# EAGLE design 2023-08-03 LVMi Thermistors (EAGLE 9.6.2)

## Sheet 1 of 4
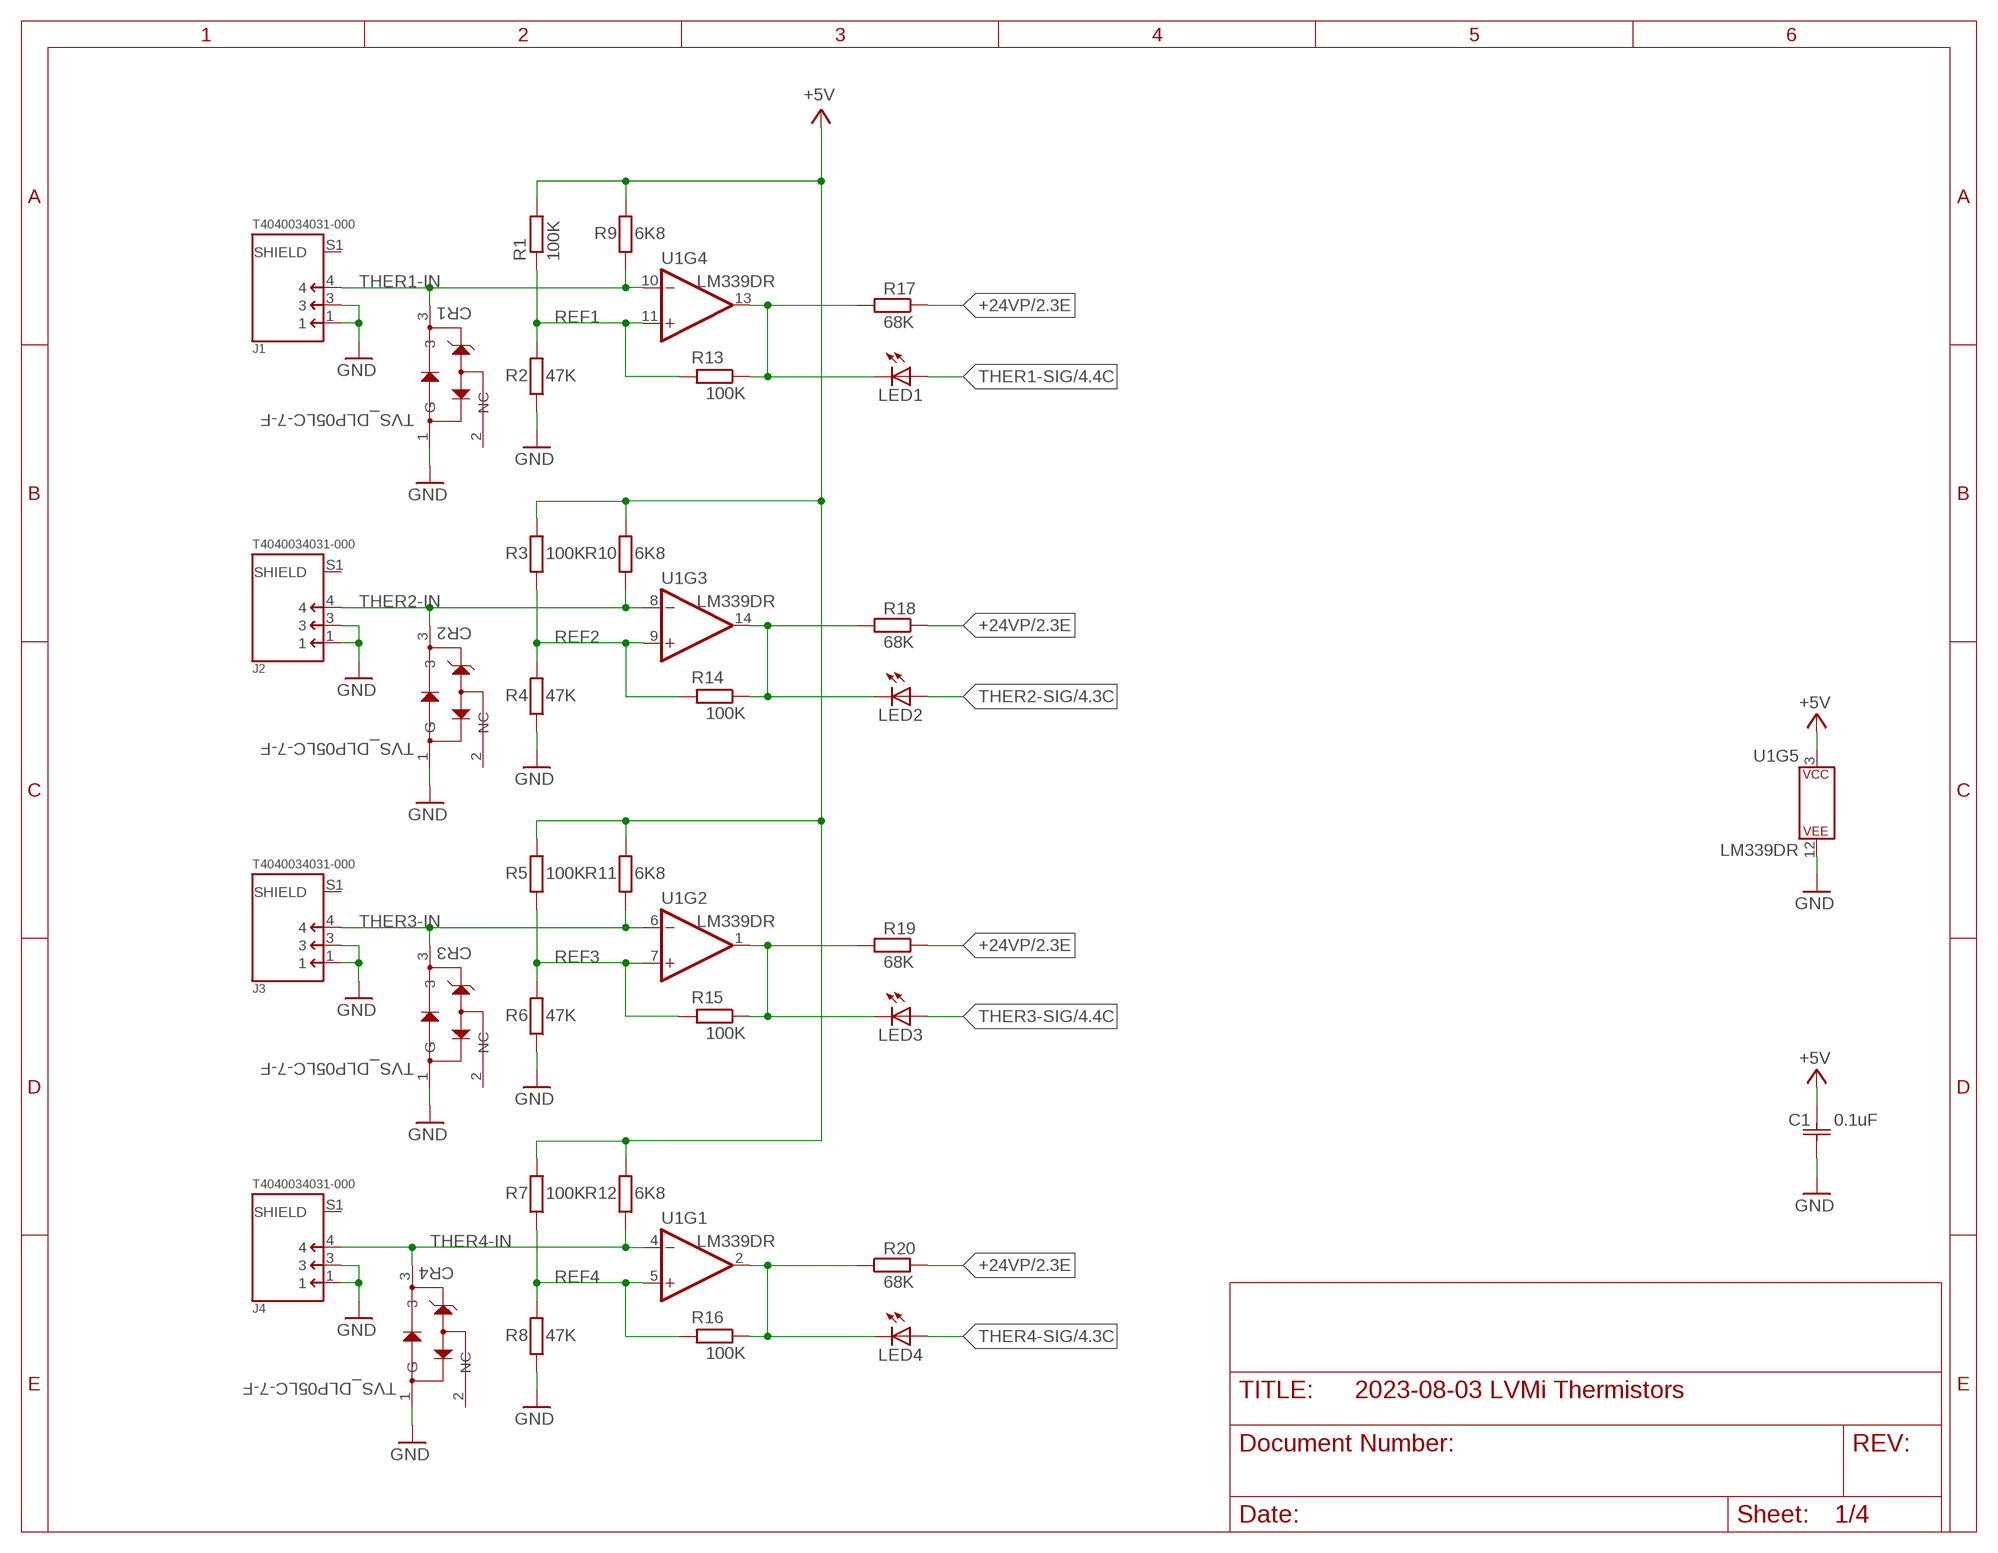
[diagram p0: schematic, sheet 1]

### Parts
C1  0.1uF  CAPTHRUHOLE  [K104K15X7RF5TL2_VIS]
CR1  TVS_DLP05LC-7-F  [SOT23_DLP05LC_DIO]
CR2  TVS_DLP05LC-7-F  [SOT23_DLP05LC_DIO]
CR3  TVS_DLP05LC-7-F  [SOT23_DLP05LC_DIO]
CR4  TVS_DLP05LC-7-F  [SOT23_DLP05LC_DIO]
J1  T4040034031-000  [TE_T4040034031-000]
J2  T4040034031-000  [TE_T4040034031-000]
J3  T4040034031-000  [TE_T4040034031-000]
J4  T4040034031-000  [TE_T4040034031-000]
LED1  LED5MM  [LED5MM]
LED2  LED5MM  [LED5MM]
LED3  LED5MM  [LED5MM]
LED4  LED5MM  [LED5MM]
R1  100K  R-EU_0204/7  [0204/7]
R2  47K  R-EU_0204/7  [0204/7]
R3  100K  R-EU_0204/7  [0204/7]
R4  47K  R-EU_0204/7  [0204/7]
R5  100K  R-EU_0204/7  [0204/7]
R6  47K  R-EU_0204/7  [0204/7]
R7  100K  R-EU_0204/7  [0204/7]
R8  47K  R-EU_0204/7  [0204/7]
R9  6K8  R-EU_0204/7  [0204/7]
R10  6K8  R-EU_0204/7  [0204/7]
R11  6K8  R-EU_0204/7  [0204/7]
R12  6K8  R-EU_0204/7  [0204/7]
R13  100K  R-EU_0204/7  [0204/7]
R14  100K  R-EU_0204/7  [0204/7]
R15  100K  R-EU_0204/7  [0204/7]
R16  100K  R-EU_0204/7  [0204/7]
R17  68K  R-EU_0204/7  [0204/7]
R18  68K  R-EU_0204/7  [0204/7]
R19  68K  R-EU_0204/7  [0204/7]
R20  68K  R-EU_0204/7  [0204/7]
U1  LM339DR  LM339SOIC-14  [SOIC127P599X175-14]

### Nets
+5V: C1.2 R1.2 R3.2 R5.2 R7.2 R9.2 R10.2 R11.2 R12.2 U1.3(P$V+) ; also sheet 2,3,4
+24VP: R17.1 R18.1 R19.1 R20.2 ; also sheet 2,3,4
GND: C1.1 CR1.1(G) CR2.1(G) CR3.1(G) CR4.1(G) J1.1 J1.3 J2.1 J2.3 J3.1 J3.3 J4.1 J4.3 R2.1 R4.1 R6.1 R8.1 U1.12(P$V-) ; also sheet 2,3,4
REF1: R1.1 R2.2 R13.2 U1.11(+IN)
REF2: R3.1 R4.2 R14.2 U1.9(+IN)
REF3: R5.1 R6.2 R15.2 U1.7(+IN)
REF4: R7.1 R8.2 R16.2 U1.5(+IN)
THER1-IN: CR1.3 J1.4 LED1.K(C) R9.1 R13.1 R17.2 U1.10(-IN) U1.13(OUT)
THER1-SIG: LED1.A ; also sheet 4
THER2-IN: CR2.3 J2.4 LED2.K(C) R10.1 R14.1 R18.2 U1.8(-IN) U1.14(OUT)
THER2-SIG: LED2.A ; also sheet 4
THER3-IN: CR3.3 J3.4 LED3.K(C) R11.1 R15.1 R19.2 U1.1(OUT) U1.6(-IN)
THER3-SIG: LED3.A ; also sheet 4
THER4-IN: CR4.3 J4.4 LED4.K(C) R12.1 R16.1 R20.1 U1.2(OUT) U1.4(-IN)
THER4-SIG: LED4.A ; also sheet 4
Unconnected: CR1.2(NC) CR2.2(NC) CR3.2(NC) CR4.2(NC) J1.S1(SHIELD) J2.S1(SHIELD) J3.S1(SHIELD) J4.S1(SHIELD)

### Notes on the sheet
- Thermistor Connectors and Comparators

## Sheet 2 of 4
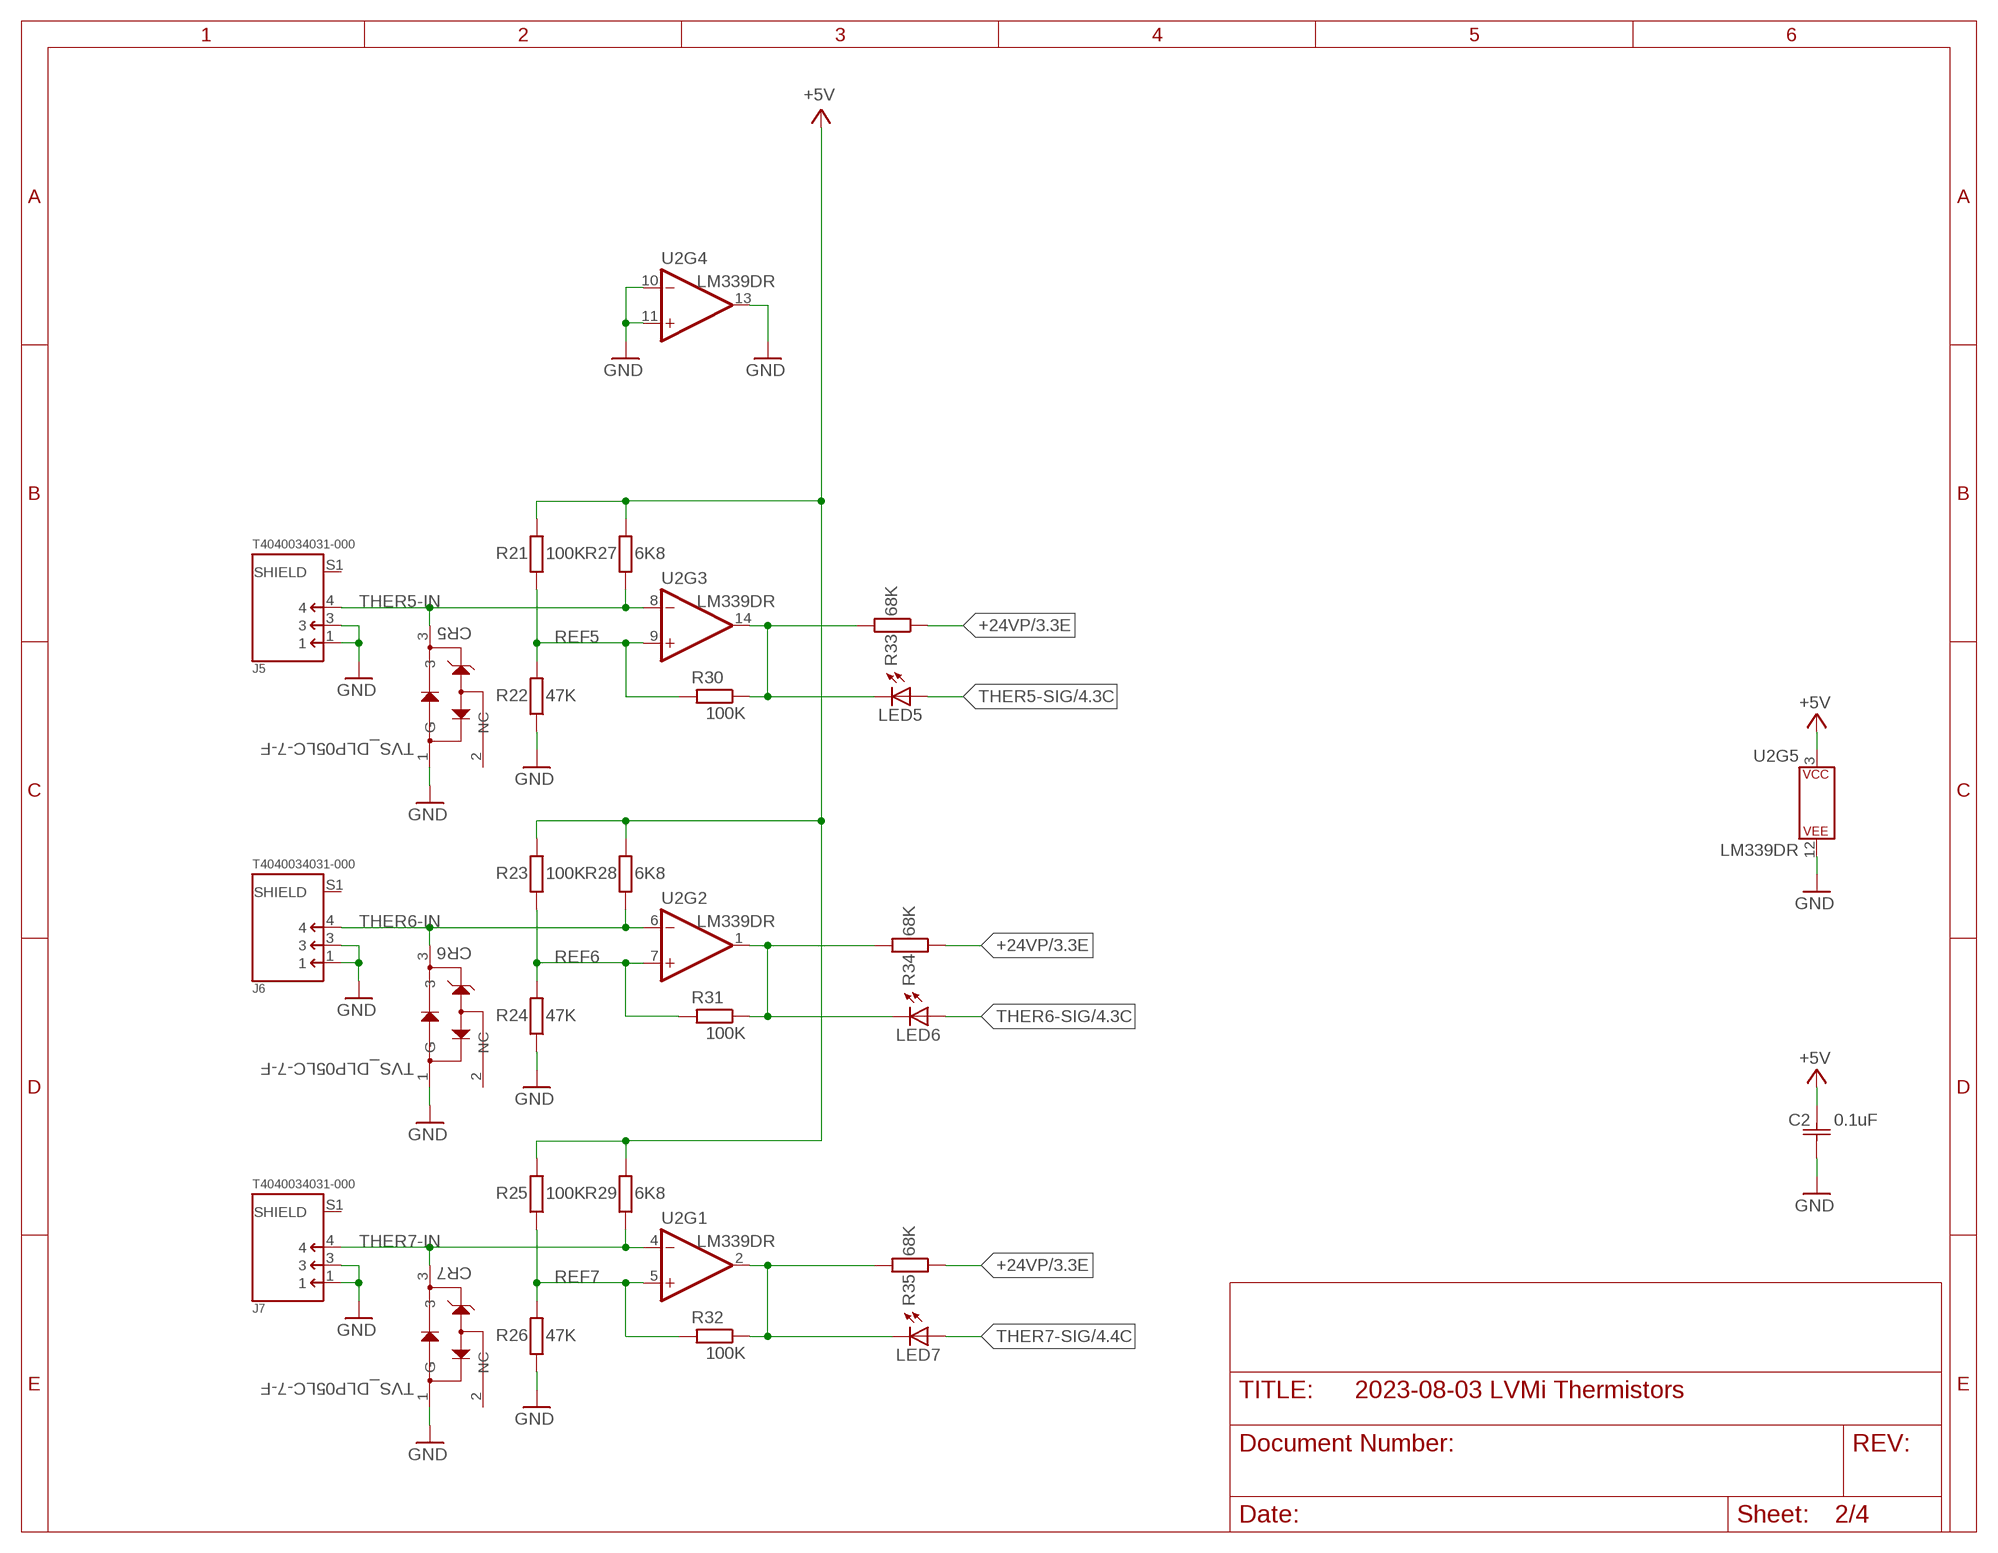
[diagram p1: schematic, sheet 2]

### Parts
C2  0.1uF  CAPTHRUHOLE  [K104K15X7RF5TL2_VIS]
CR5  TVS_DLP05LC-7-F  [SOT23_DLP05LC_DIO]
CR6  TVS_DLP05LC-7-F  [SOT23_DLP05LC_DIO]
CR7  TVS_DLP05LC-7-F  [SOT23_DLP05LC_DIO]
J5  T4040034031-000  [TE_T4040034031-000]
J6  T4040034031-000  [TE_T4040034031-000]
J7  T4040034031-000  [TE_T4040034031-000]
LED5  LED5MM  [LED5MM]
LED6  LED5MM  [LED5MM]
LED7  LED5MM  [LED5MM]
R21  100K  R-EU_0204/7  [0204/7]
R22  47K  R-EU_0204/7  [0204/7]
R23  100K  R-EU_0204/7  [0204/7]
R24  47K  R-EU_0204/7  [0204/7]
R25  100K  R-EU_0204/7  [0204/7]
R26  47K  R-EU_0204/7  [0204/7]
R27  6K8  R-EU_0204/7  [0204/7]
R28  6K8  R-EU_0204/7  [0204/7]
R29  6K8  R-EU_0204/7  [0204/7]
R30  100K  R-EU_0204/7  [0204/7]
R31  100K  R-EU_0204/7  [0204/7]
R32  100K  R-EU_0204/7  [0204/7]
R33  68K  R-EU_0204/7  [0204/7]
R34  68K  R-EU_0204/7  [0204/7]
R35  68K  R-EU_0204/7  [0204/7]
U2  LM339DR  LM339SOIC-14  [SOIC127P599X175-14]

### Nets
+5V: C2.2 R21.2 R23.2 R25.2 R27.2 R28.2 R29.2 U2.3(P$V+) ; also sheet 1,3,4
+24VP: R33.1 R34.1 R35.1 ; also sheet 1,3,4
GND: C2.1 CR5.1(G) CR6.1(G) CR7.1(G) J5.1 J5.3 J6.1 J6.3 J7.1 J7.3 R22.1 R24.1 R26.1 U2.10(-IN) U2.11(+IN) U2.12(P$V-) U2.13(OUT) ; also sheet 1,3,4
REF5: R21.1 R22.2 R30.2 U2.9(+IN)
REF6: R23.1 R24.2 R31.2 U2.7(+IN)
REF7: R25.1 R26.2 R32.2 U2.5(+IN)
THER5-IN: CR5.3 J5.4 LED5.K(C) R27.1 R30.1 R33.2 U2.8(-IN) U2.14(OUT)
THER5-SIG: LED5.A ; also sheet 4
THER6-IN: CR6.3 J6.4 LED6.K(C) R28.1 R31.1 R34.2 U2.1(OUT) U2.6(-IN)
THER6-SIG: LED6.A ; also sheet 4
THER7-IN: CR7.3 J7.4 LED7.K(C) R29.1 R32.1 R35.2 U2.2(OUT) U2.4(-IN)
THER7-SIG: LED7.A ; also sheet 4
Unconnected: CR5.2(NC) CR6.2(NC) CR7.2(NC) J5.S1(SHIELD) J6.S1(SHIELD) J7.S1(SHIELD)

## Sheet 3 of 4
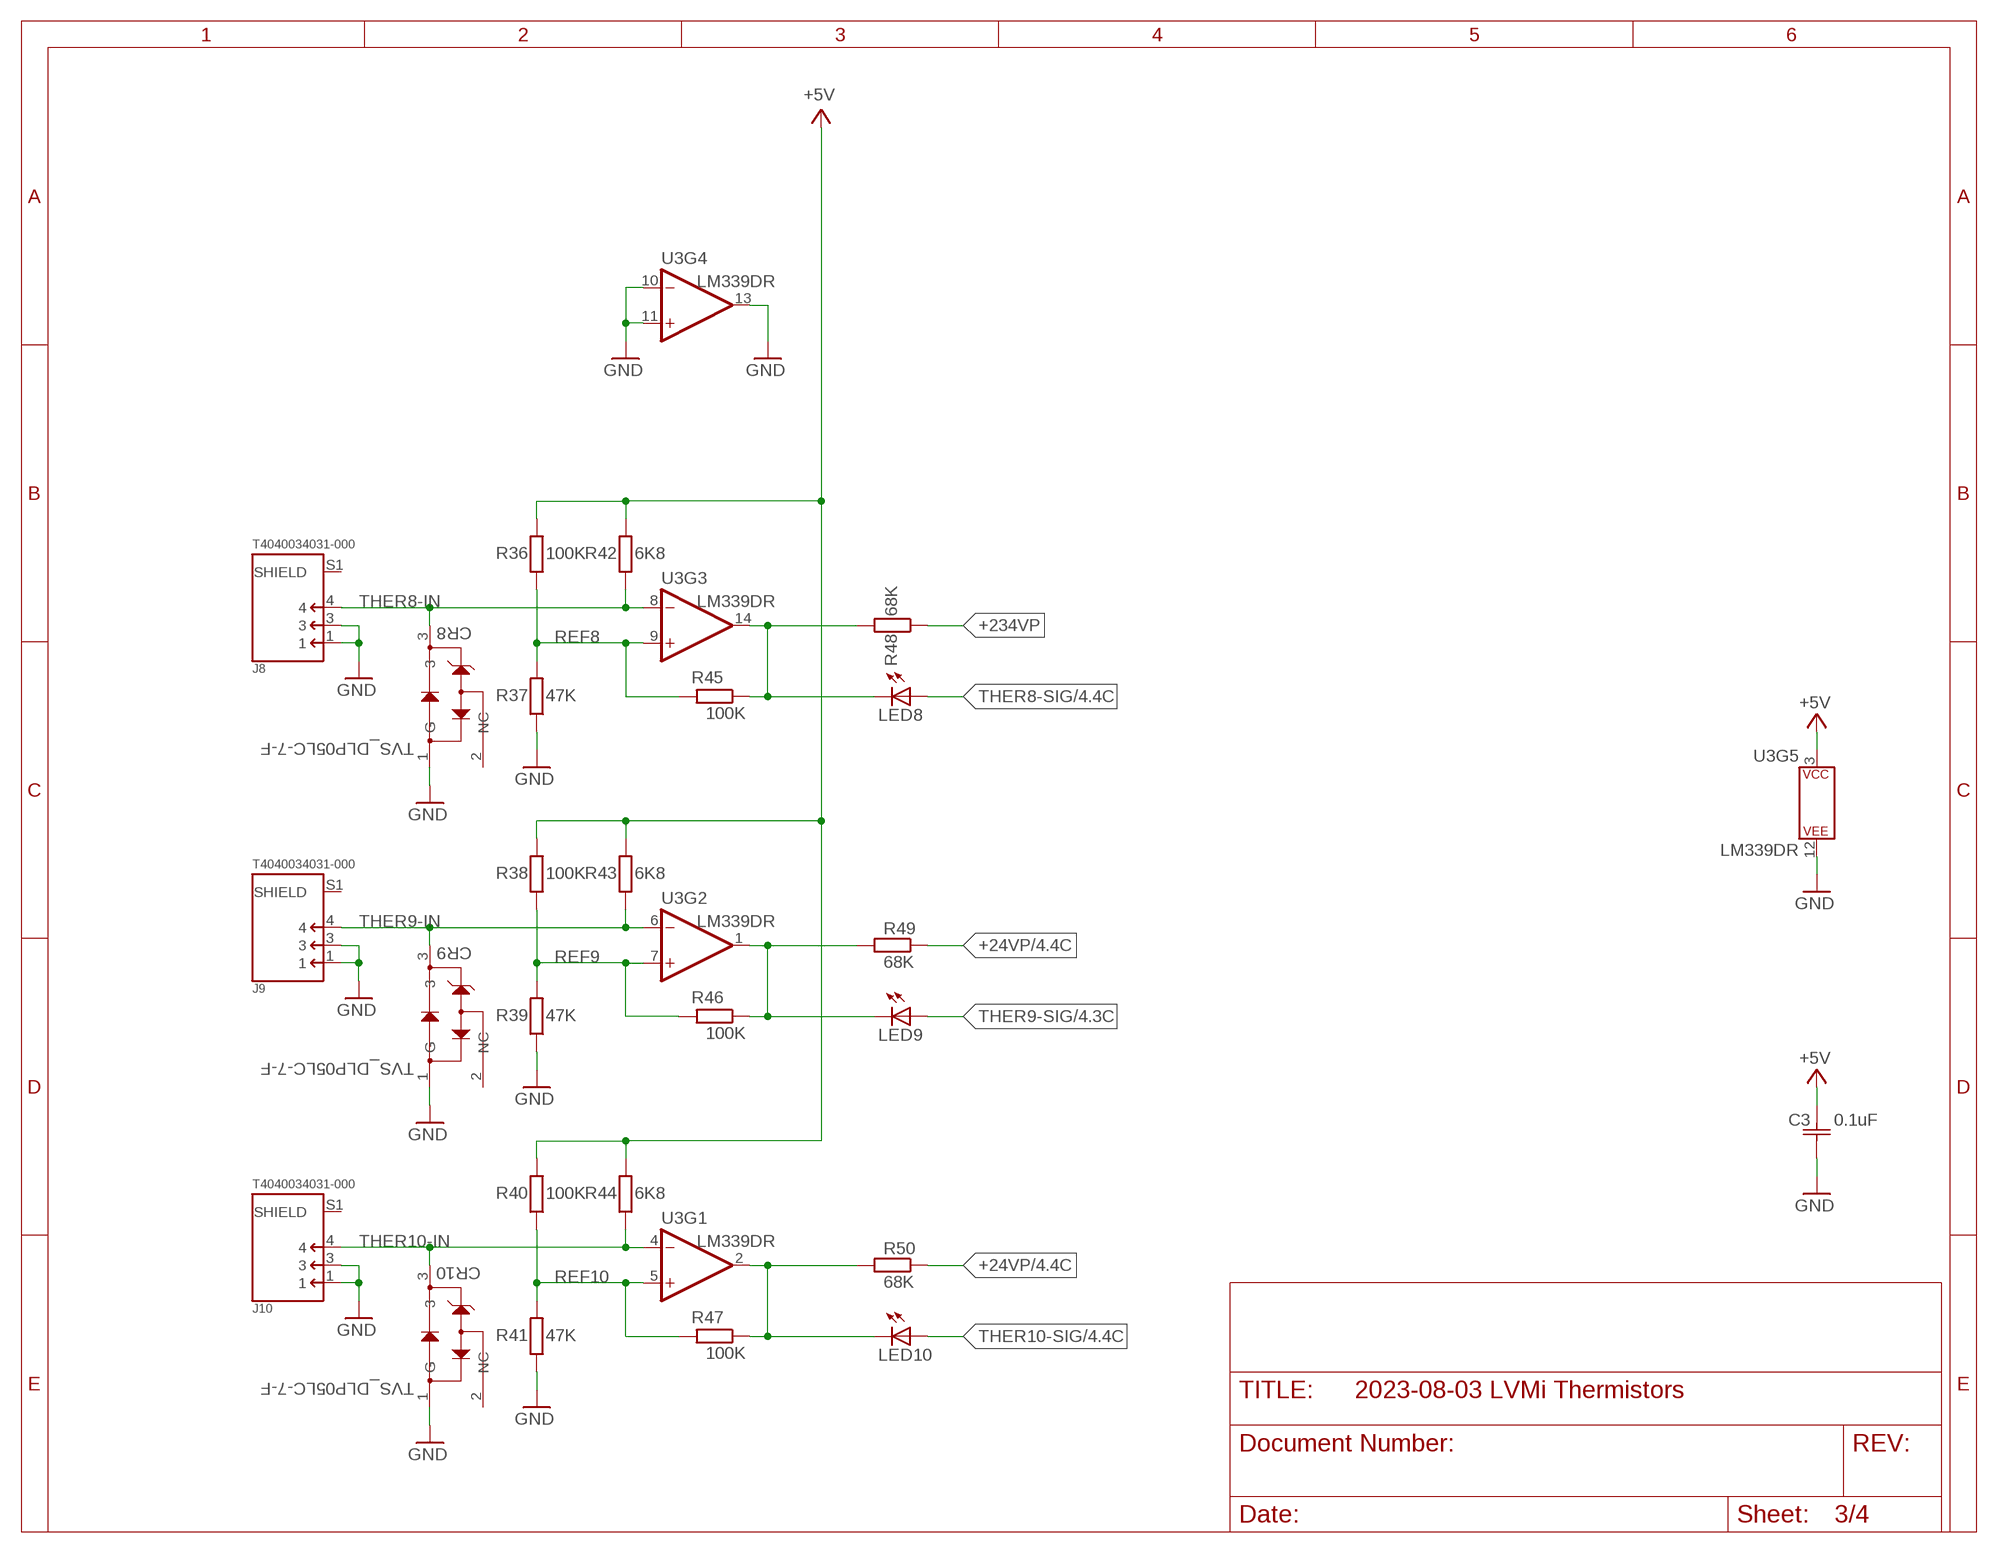
[diagram p2: schematic, sheet 3]

### Parts
C3  0.1uF  CAPTHRUHOLE  [K104K15X7RF5TL2_VIS]
CR8  TVS_DLP05LC-7-F  [SOT23_DLP05LC_DIO]
CR9  TVS_DLP05LC-7-F  [SOT23_DLP05LC_DIO]
CR10  TVS_DLP05LC-7-F  [SOT23_DLP05LC_DIO]
J8  T4040034031-000  [TE_T4040034031-000]
J9  T4040034031-000  [TE_T4040034031-000]
J10  T4040034031-000  [TE_T4040034031-000]
LED8  LED5MM  [LED5MM]
LED9  LED5MM  [LED5MM]
LED10  LED5MM  [LED5MM]
R36  100K  R-EU_0204/7  [0204/7]
R37  47K  R-EU_0204/7  [0204/7]
R38  100K  R-EU_0204/7  [0204/7]
R39  47K  R-EU_0204/7  [0204/7]
R40  100K  R-EU_0204/7  [0204/7]
R41  47K  R-EU_0204/7  [0204/7]
R42  6K8  R-EU_0204/7  [0204/7]
R43  6K8  R-EU_0204/7  [0204/7]
R44  6K8  R-EU_0204/7  [0204/7]
R45  100K  R-EU_0204/7  [0204/7]
R46  100K  R-EU_0204/7  [0204/7]
R47  100K  R-EU_0204/7  [0204/7]
R48  68K  R-EU_0204/7  [0204/7]
R49  68K  R-EU_0204/7  [0204/7]
R50  68K  R-EU_0204/7  [0204/7]
U3  LM339DR  LM339SOIC-14  [SOIC127P599X175-14]

### Nets
+5V: C3.2 R36.2 R38.2 R40.2 R42.2 R43.2 R44.2 U3.3(P$V+) ; also sheet 1,2,4
+24VP: R49.1 R50.1 ; also sheet 1,2,4
+234VP: R48.1
GND: C3.1 CR8.1(G) CR9.1(G) CR10.1(G) J8.1 J8.3 J9.1 J9.3 J10.1 J10.3 R37.1 R39.1 R41.1 U3.10(-IN) U3.11(+IN) U3.12(P$V-) U3.13(OUT) ; also sheet 1,2,4
REF8: R36.1 R37.2 R45.2 U3.9(+IN)
REF9: R38.1 R39.2 R46.2 U3.7(+IN)
REF10: R40.1 R41.2 R47.2 U3.5(+IN)
THER8-IN: CR8.3 J8.4 LED8.K(C) R42.1 R45.1 R48.2 U3.8(-IN) U3.14(OUT)
THER8-SIG: LED8.A ; also sheet 4
THER9-IN: CR9.3 J9.4 LED9.K(C) R43.1 R46.1 R49.2 U3.1(OUT) U3.6(-IN)
THER9-SIG: LED9.A ; also sheet 4
THER10-IN: CR10.3 J10.4 LED10.K(C) R44.1 R47.1 R50.2 U3.2(OUT) U3.4(-IN)
THER10-SIG: LED10.A ; also sheet 4
Unconnected: CR8.2(NC) CR9.2(NC) CR10.2(NC) J8.S1(SHIELD) J9.S1(SHIELD) J10.S1(SHIELD)

## Sheet 4 of 4
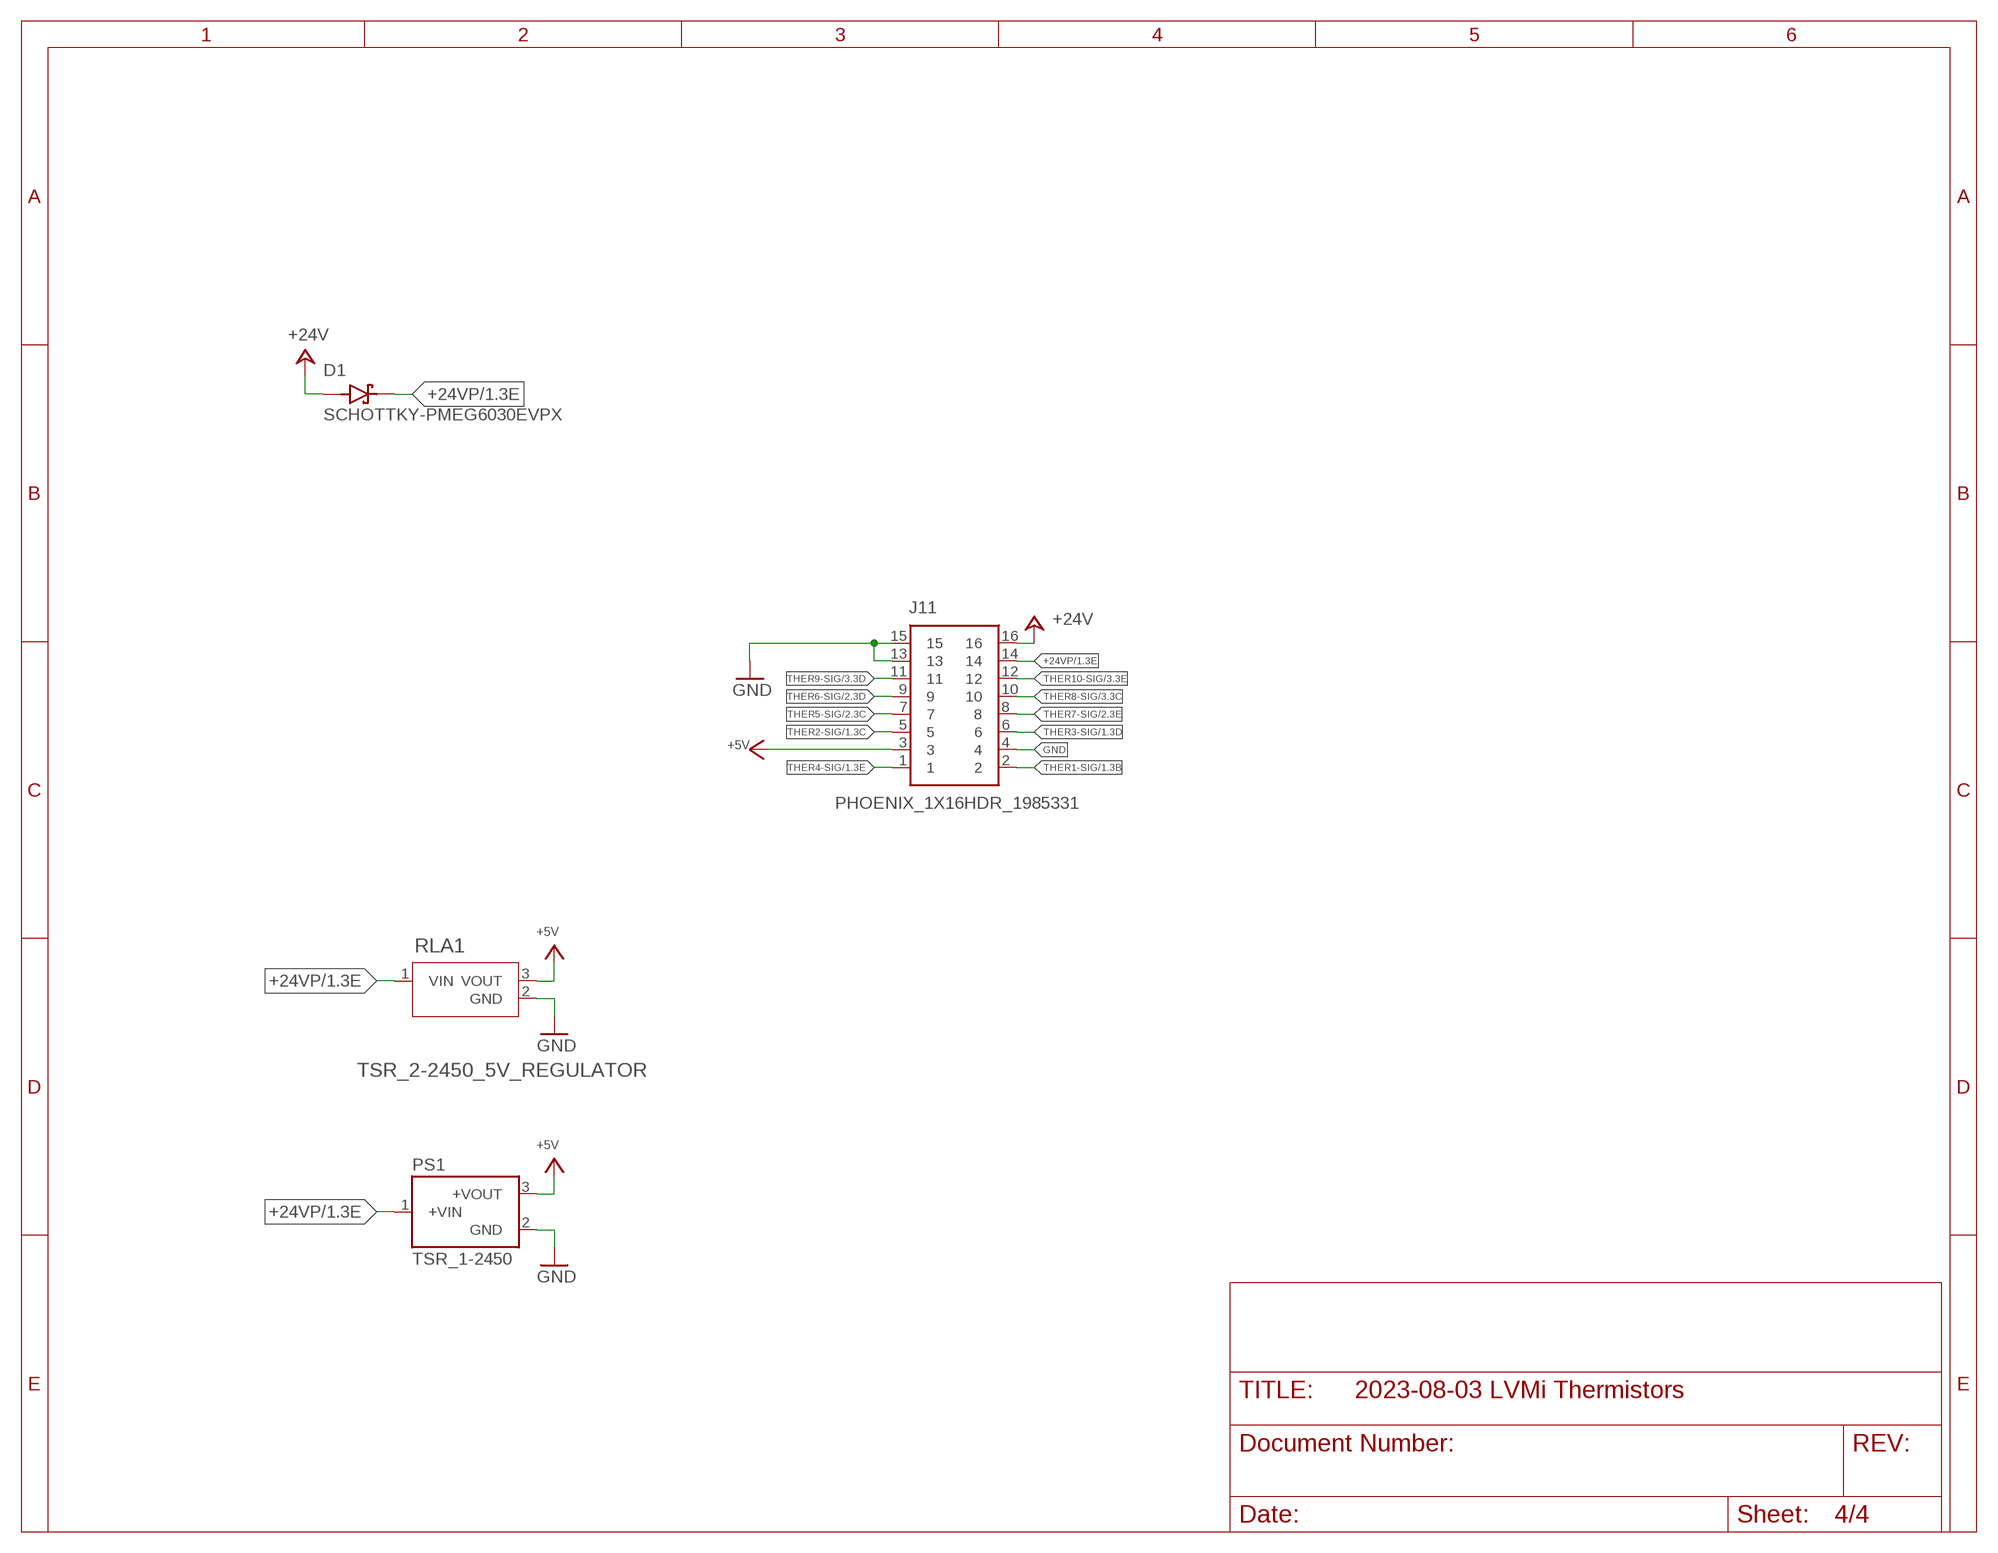
[diagram p3: schematic, sheet 4]

### Parts
D1  SCHOTTKY-PMEG6030EVPX  [DIO_PMEG6030EVPX]
J11  PHOENIX_1X16HDR_1985331  [1985331]
PS1  TSR_1-2450  [CONV_TSR_1-2450]
RLA1  TSR_2-2450_5V_REGULATOR  [TSR2-SINGLE_TRP]

### Nets
+5V: J11.3 PS1.3(+VOUT) RLA1.3(VOUT) ; also sheet 1,2,3
+24V: D1.2(A) J11.16
+24VP: D1.1(K) J11.14 PS1.1(+VIN) RLA1.1(VIN) ; also sheet 1,2,3
GND: J11.4 J11.13 J11.15 PS1.2(GND) RLA1.2(GND) ; also sheet 1,2,3
THER1-SIG: J11.2 ; also sheet 1
THER2-SIG: J11.5 ; also sheet 1
THER3-SIG: J11.6 ; also sheet 1
THER4-SIG: J11.1 ; also sheet 1
THER5-SIG: J11.7 ; also sheet 2
THER6-SIG: J11.9 ; also sheet 2
THER7-SIG: J11.8 ; also sheet 2
THER8-SIG: J11.10 ; also sheet 3
THER9-SIG: J11.11 ; also sheet 3
THER10-SIG: J11.12 ; also sheet 3

## Library data of the parts
C1-C3 = AUmlib:CAPTHRUHOLE; COPYRIGHT: Copyright (C) 2023 Ultra Librarian. All rights reserved.; MANUFACTURER_PART_NUMBER: K104K15X7RF5TL2; MFR_NAME: Vishay; TYPE: Ceramic Capacitor
CR1-CR10 = AUmlib:TVS_DLP05LC-7-F; COPYRIGHT: Copyright (C) 2023 Ultra Librarian. All rights reserved.; MANUFACTURER_PART_NUMBER: DLP05LC-7-F; MFR_NAME: Diodes Inc
D1 = AUmlib:SCHOTTKY-PMEG6030EVPX: PMEG6030 Series 60 V 3 A Surface Mount Schottky Barrier Rectifier - SOD-128; DESCRIPTION: Diode Schottky 60V 3A Surface Mount SOD-128/CFP5; DIGI-KEY_PART_NUMBER: 1727-1349-1-ND; MF: Nexperia USA; MP: PMEG6030EVPX; PACKAGE: CFP5-2 Nexperia USA Inc.; PURCHASE-URL: https://pricing.snapeda.com/search/part/PMEG6030EVPX/?ref=eda
J1-J10 = AUmlib:T4040034031-000: Male Receptacle Connector M8.FMLE.PNLREAR.3POS.STR PCBSHLD 3 POS; MANUFACTURER: TE; MAXIMUM_PACKAGE_HEIGHT: 15.7mm; PARTREV: Rev A; STANDARD: Manufacturer Recommendations
J11 = AUmlib:PHOENIX_1X16HDR_1985331: PTSA 1,5/16-3,5-Z Source: Datasheet <https://datasheet.datasheetarchive.com/originals/distributors/SFDatasheet-2/sf-00059086.pdf>; DESCRIPTION: PTSA 1,5/16-3,5-Z; HEIGHT: 13.1mm; MANUFACTURER_NAME: Phoenix Contact; MANUFACTURER_PART_NUMBER: 1985331; MOUSER_PART_NUMBER: 651-1985331; MOUSER_PRICE-STOCK: https://www.mouser.co.uk/ProductDetail/Phoenix-Contact/1985331?qs=uD%2FdkN7XIa2gzzUd7QLZ1Q%3D%3D
LED1-LED10 = AUmlib:LED: LED OSRAM: - CHIPLED LG R971, LG N971, LY N971, LG Q971, LY Q971, LO R971, LY R971 LH N974, LH R974 LS Q976, LO Q976, LY Q976 LO Q996 - Hyper CHIPLED LW Q18S LB Q993, LB Q99A, LB R99A - SideLED LS A670, LO A670, LY A670, LG A670, LP A670 LB A673, LV A673, LT A673, LW A673 LH A674 LY A675 LS A676, LA A676, LO A676, LY A676, LW A676 LS A679, LY A679, LG A679 - Hyper Micro SIDELED® LS Y876, LA Y876, LO Y876, LY Y876 LT Y87S - SmartLED LW L88C, LW L88S LB L89C, LB L89S, LG L890 LS L89K, LO L89K, LY L89K LS L896, LA L896, LO L896, LY L896 - TOPLED LS T670, LO T670, LY T670, LG T670, LP T670 LSG T670, LSP T670, LSY T670, LOP T670, LYG T670 LG T671, LOG T671, LSG T671 LB T673, LV T673, LT T673, LW T673 LH T674 LS T676, LA T676, LO T676, LY T676, LB T676, LH T676, LSB T676, LW T676 LB T67C, LV T67C, LT T67C, LS T67K, LO T67K, LY T67K, LW E67C LS E67B, LA E67B, LO E67B, LY E67B, LB E67C, LV E67C, LT E67C LW T67C LS T679, LY T679, LG T679 LS T770, LO T770, LY T770, LG T770, LP T770 LB T773, LV T773, LT T773, LW T773 LH T774 LS E675, LA E675, LY E675, LS T675 LS T776, LA T776, LO T776, LY T776, LB T776 LHGB T686 LT T68C, LB T68C - Hyper Mini TOPLED® LB M676 - Mini TOPLED Santana® LG M470 LS M47K, LO M47K, LY M47K Source: http://www.osram.convergy.de LUXEON: - LUMILED® LXK2-PW12-R00, LXK2-PW12-S00, LXK2-PW14-U00, LXK2-PW14-V00 LXK2-PM12-R00, LXK2-PM12-S00, LXK2-PM14-U00 LXK2-PE12-Q00, LXK2-PE12-R00, LXK2-PE12-S00, LXK2-PE14-T00, LXK2-PE14-U00 LXK2-PB12-K00, LXK2-PB12-L00, LXK2-PB12-M00, LXK2-PB14-N00, LXK2-PB14-P00, LXK2-PB14-Q00 LXK2-PR12-L00, LXK2-PR12-M00, LXK2-PR14-Q00, LXK2-PR14-R00 LXK2-PD12-Q00, LXK2-PD12-R00, LXK2-PD12-S00 LXK2-PH12-R00, LXK2-PH12-S00 LXK2-PL12-P00, LXK2-PL12-Q00, LXK2-PL12-R00 Source: www.luxeon.com KINGBRIGHT: KA-3528ASYC Source: www.kingbright.com
PS1 = AUmlib:TSR_1-2450; MANUFACTURER: Traco Power; MAXIMUM_PACKAGE_HEIGHT: 10.6mm; PARTREV: Apr 27, 2020; STANDARD: Manufacturer Recommendations
R1-R50 = AUmlib:R-EU_: RESISTOR, European symbol; SPICEPREFIX: R
RLA1 = AUmlib:TSR_2-2450_5V_REGULATOR; COPYRIGHT: Copyright (C) 2022 Ultra Librarian. All rights reserved.; DIGI-KEY_PART_NUMBER_1: 1951-2692-ND; MANUFACTURER_PART_NUMBER: TSR 2-2450; MFR_NAME: Traco Power
U1-U3 = AUmlib:LM339: Quad Comparator - LM339PWR Based on information from the SLCS006N datasheet from TI (www.ti.com). Created by nick@scantool.net, 2008. Updated 2016. SparkFun Products SparkFun OBD-II UART <https://www.sparkfun.com/products/9555> (WIG-09555) SparkFun Car Diagnostics Kit <https://www.sparkfun.com/products/10769> (RTL-10769)

## Board
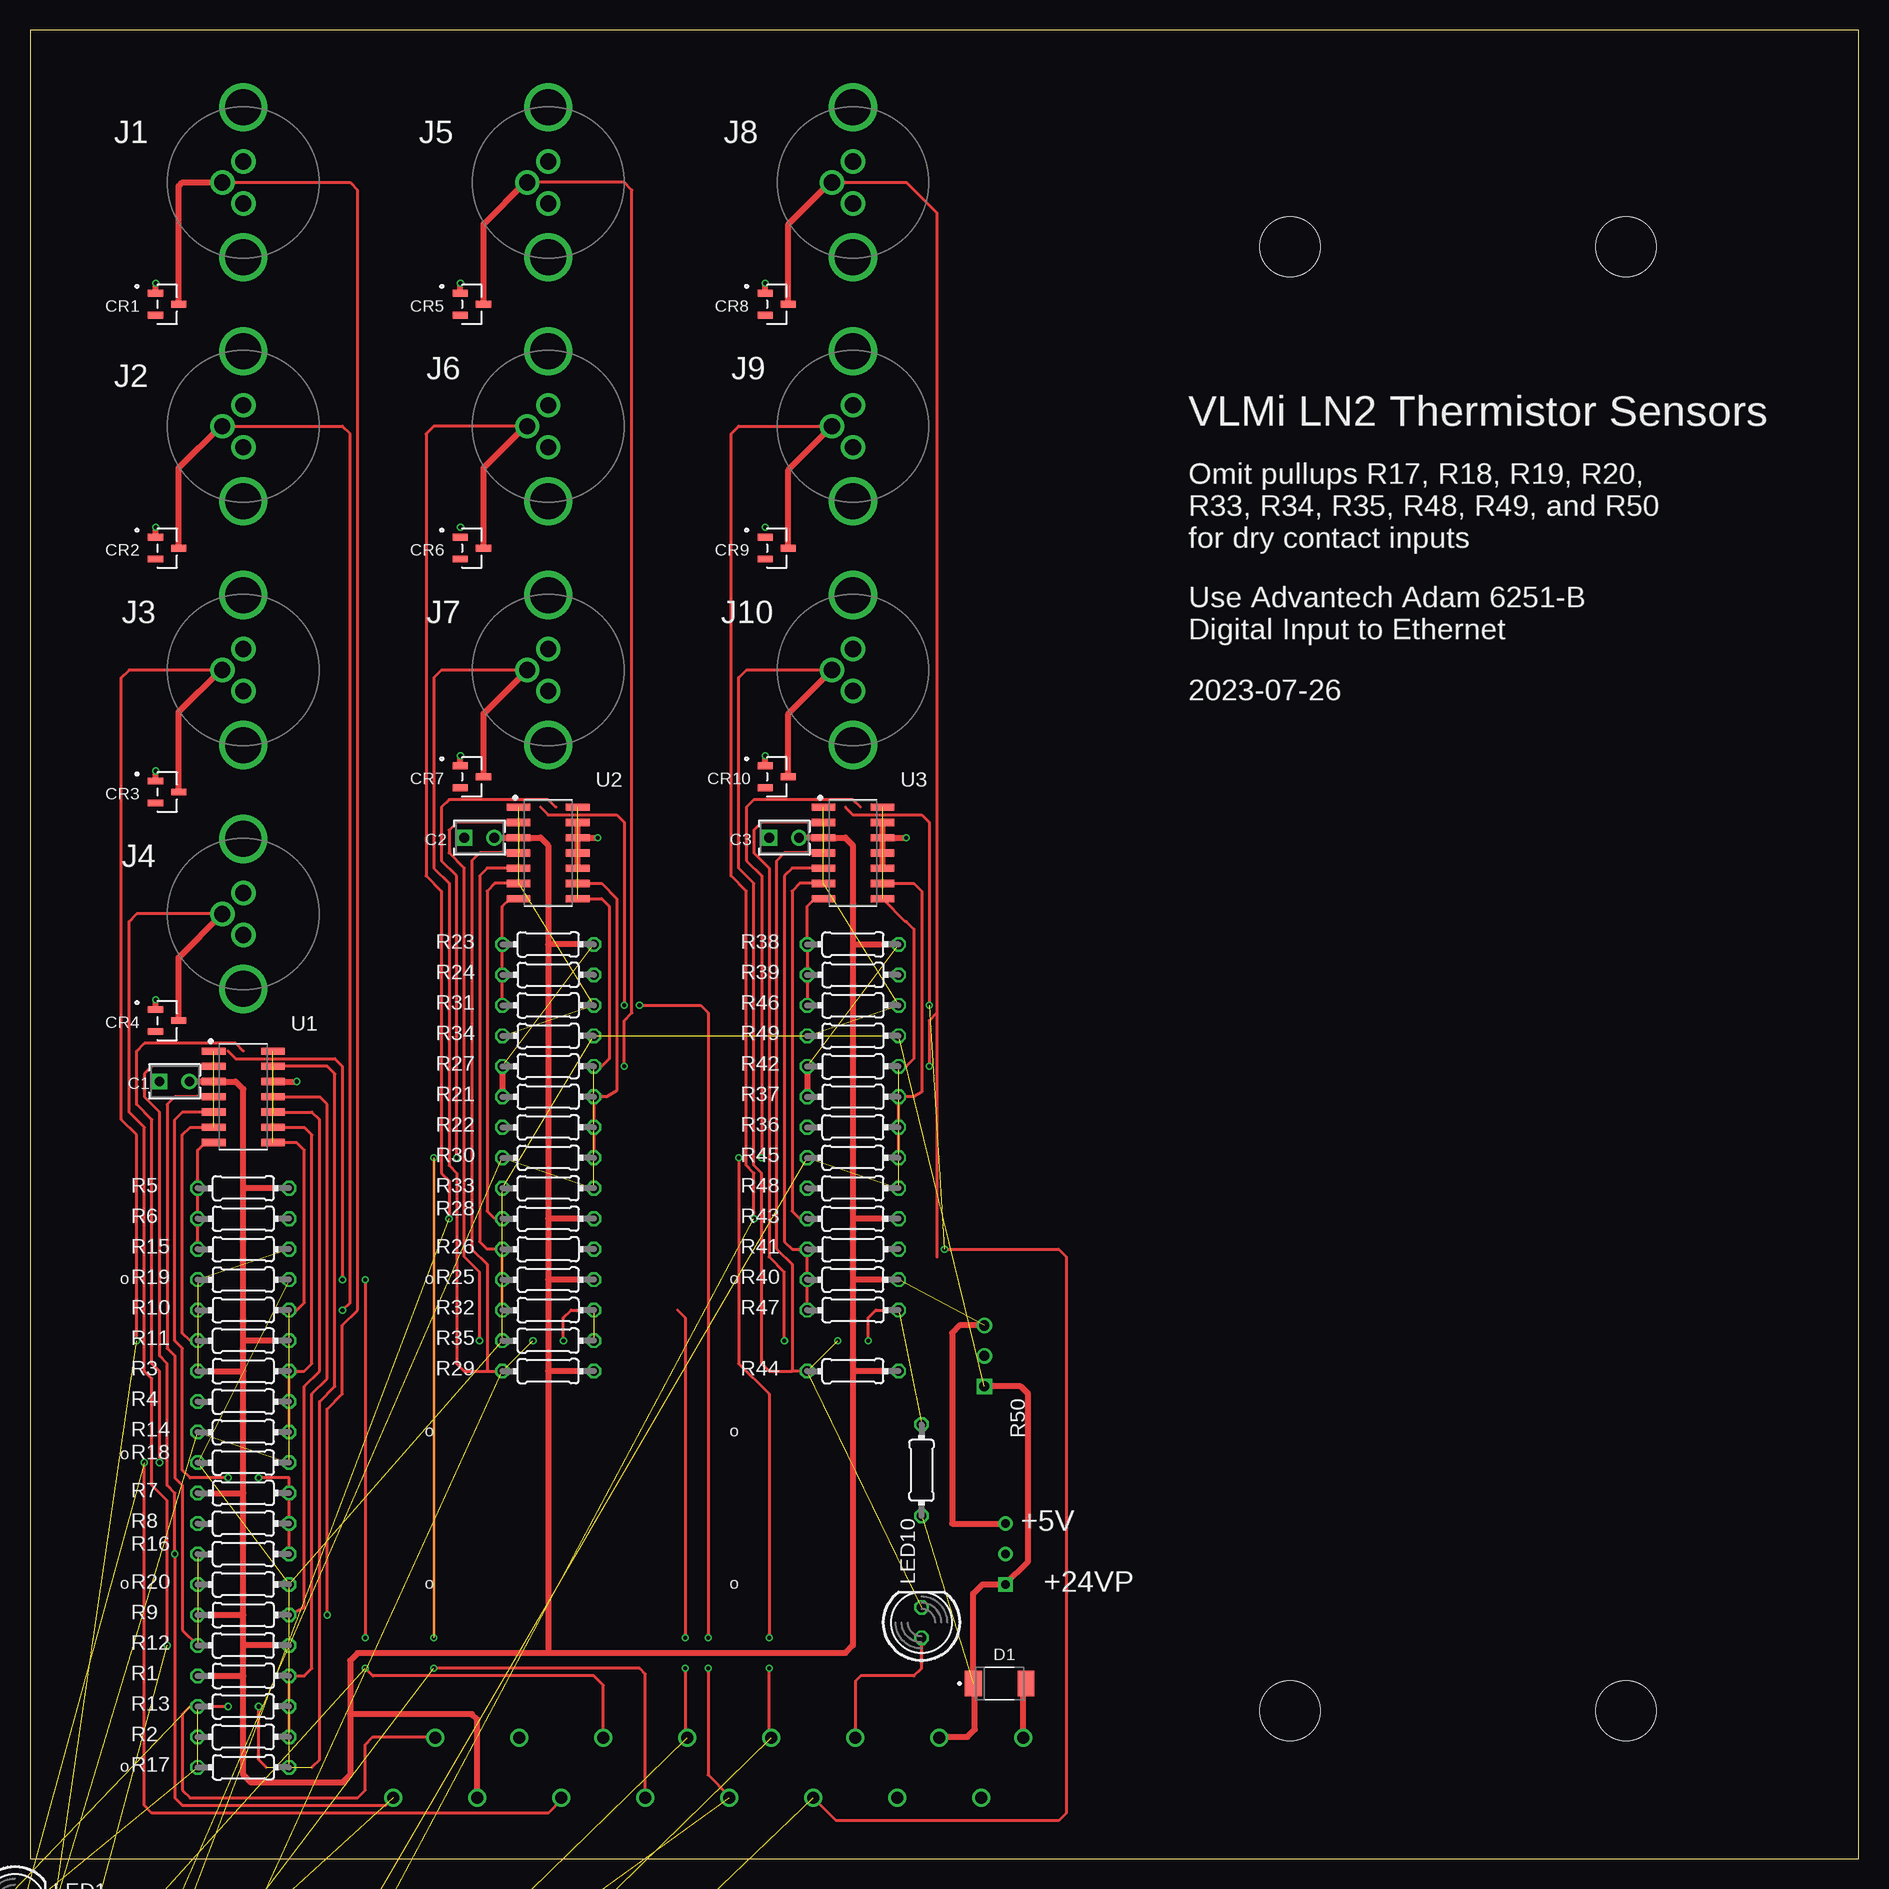
[diagram p4: board, top side]
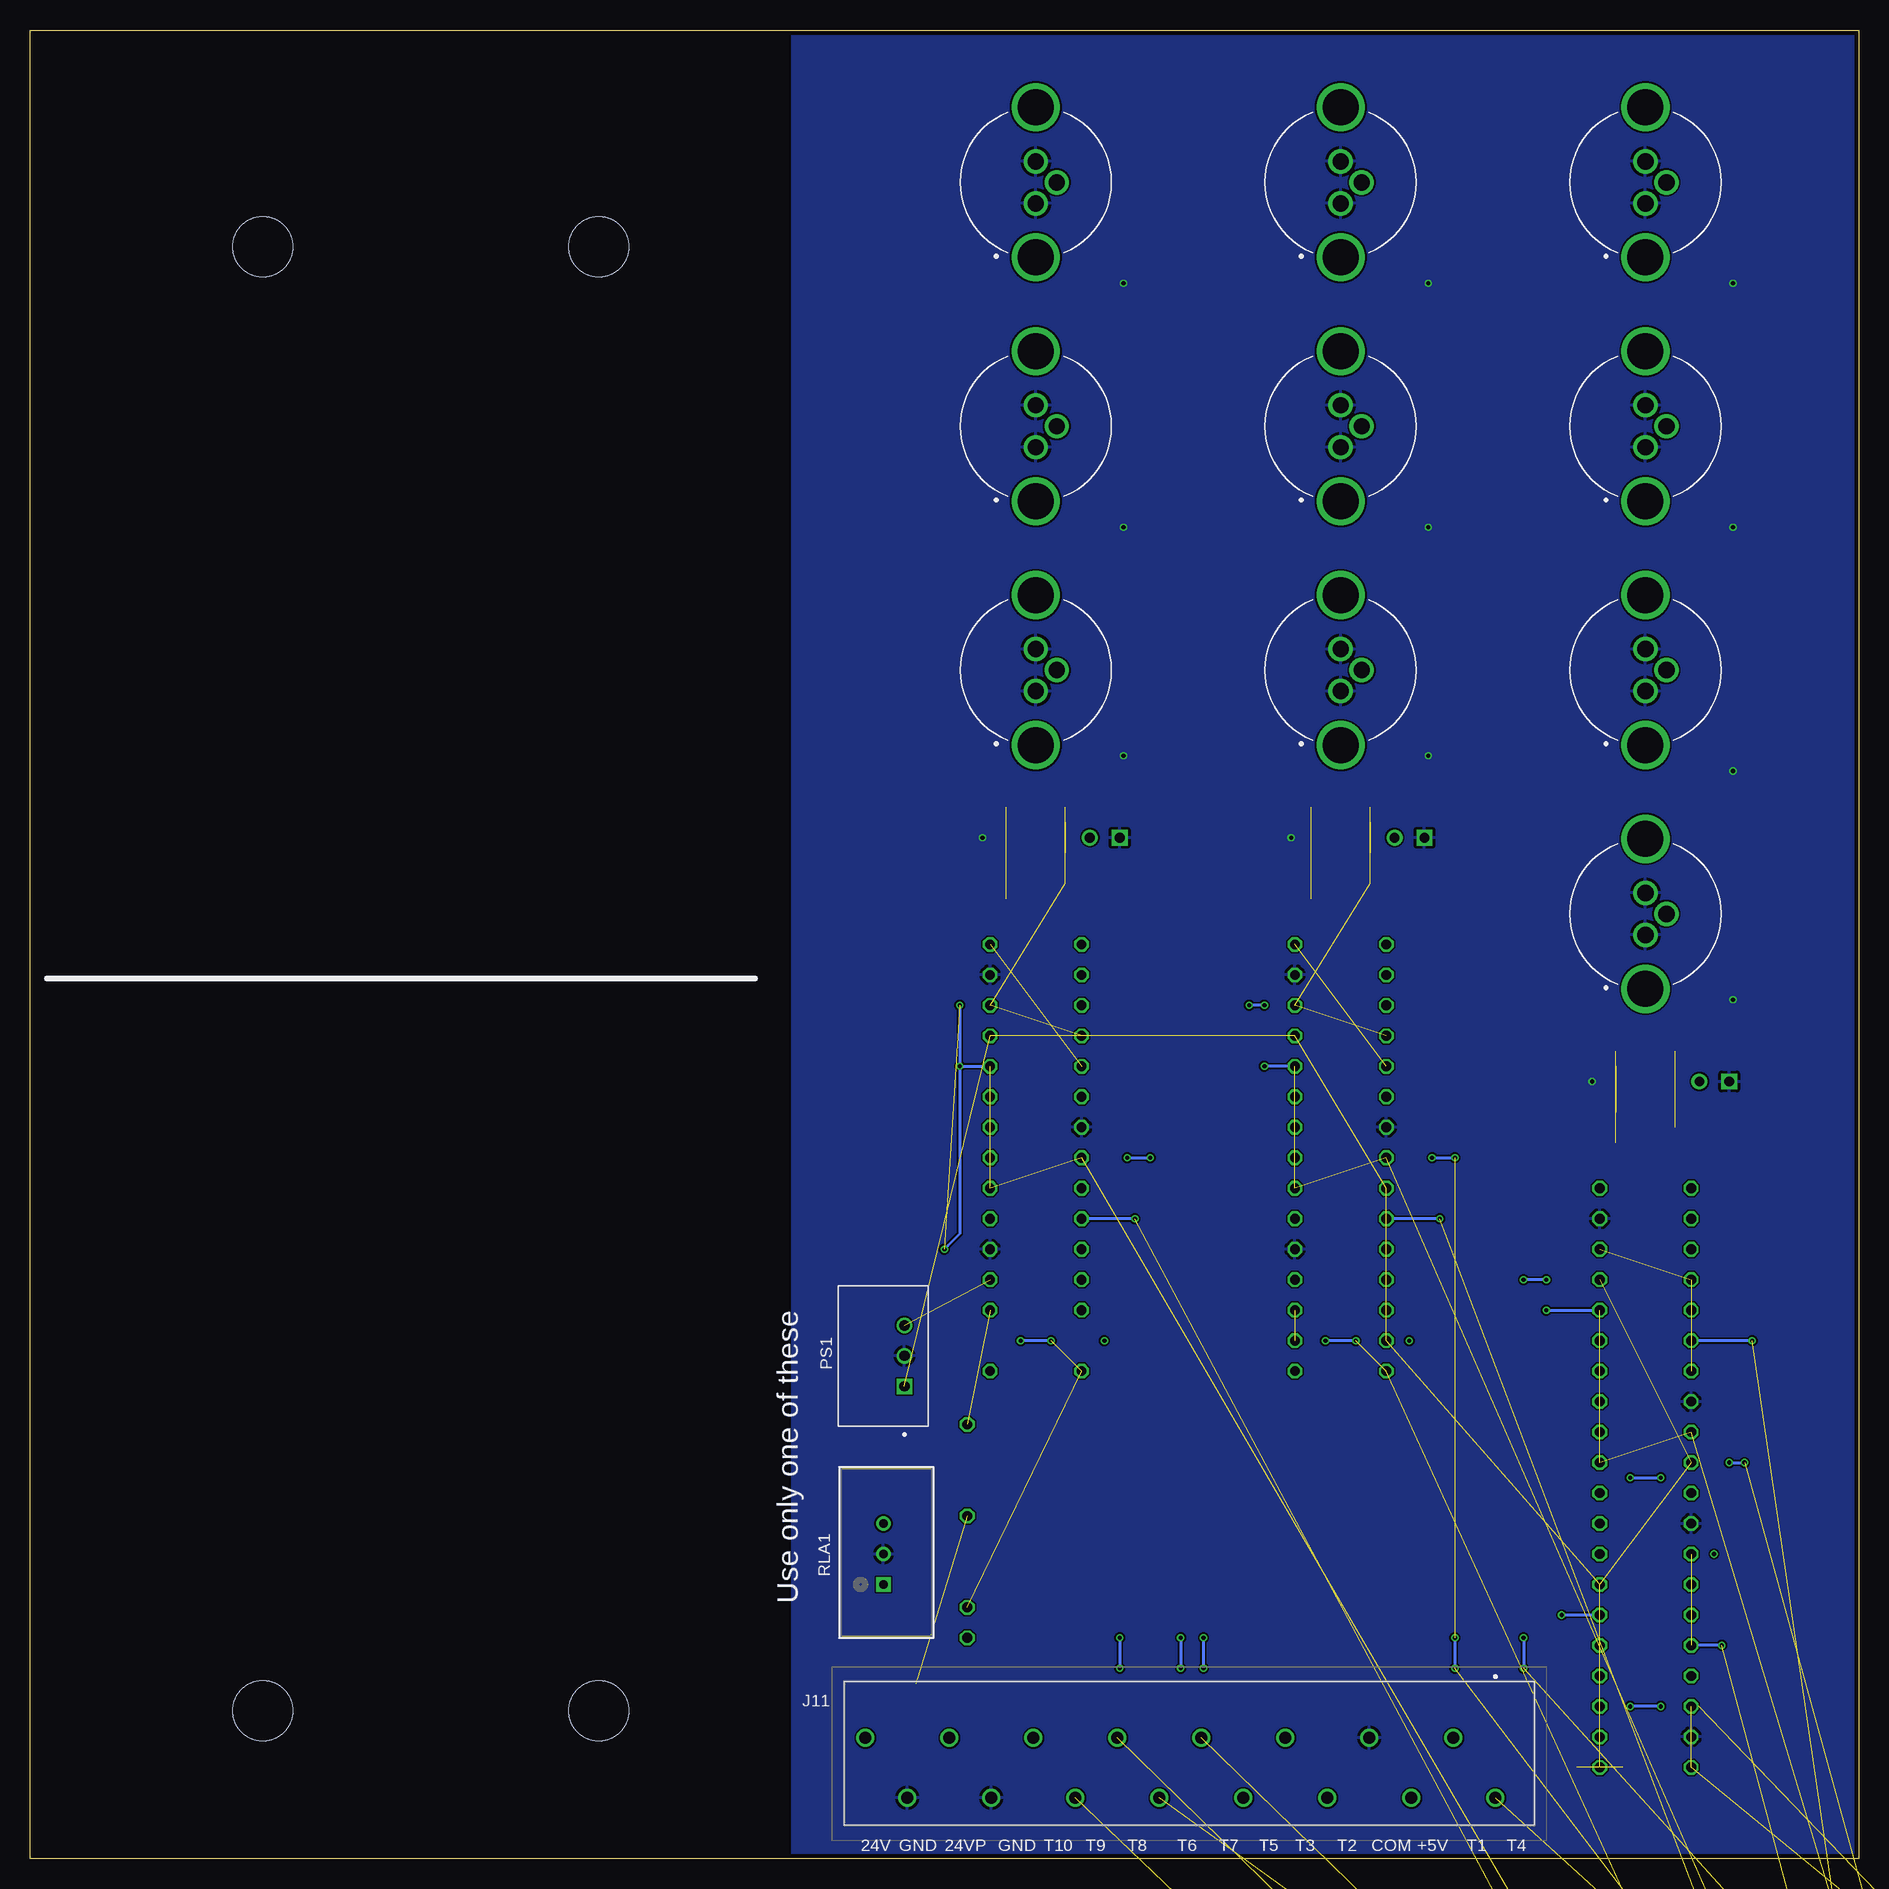
[diagram p5: board, bottom side, seen from below]

Size 152.4 x 152.4 mm. Coordinates in mm from the lower left corner, seen from the top.
Outline: 0,0 152.4,0 152.4,152.4 0,152.4 0,0
Copper layers (1*16): Top 0.035559375mm / dielectric 1.6mm / Bottom 0.035559375mm
Design rules "oshpark-2layer": minimum track width 6mil, minimum drill 10mil, track to track 6mil, track to pad 6mil, pad to pad 6mil, via to via 6mil, smd to smd 6mil, copper to edge 15mil, drill to drill 6mil, minimum pad ring 5mil, minimum via ring 5mil, stop-mask expansion 2.5mil, vias tented up to drill 0mil, thermal gap 10mil
Holes 5 mm at 105,12.35 133,12.35 105,134.35 133,134.35

### Footprints (pad centres in the part's own frame; a part is rotated, then mirrored left to right if it is on the bottom)
K104K15X7RF5TL2_VIS = drill 0.813 pad 1.321 square: 1 0,0 | drill 0.813 pad 1.321: 2 2.489,0
SOT23_DLP05LC_DIO = smd 0.559 x 1.27: 1 -0.915,-0.965; 2 0.915,-0.965; 3 0,0.965
DIO_PMEG6030EVPX = smd 1.4 x 2.1: 1 -2.2,0; 2 2.2,0
TE_T4040034031-000 = drill 1.35 pad 1.85: 1 -1.75,0; 3 1.75,0; 4 0,1.75 | drill 3: S1 6.25,0; S2 -6.25,0
1985331 = drill 1 pad 1.5: 1 51,-7.62; 2 47.5,-2.62; 3 44,-7.62; 4 40.5,-2.62; 5 37,-7.62; 6 33.5,-2.62; 7 30,-7.62; 8 26.5,-2.62; 9 23,-7.62; 10 19.5,-2.62; 11 16,-7.62; 12 12.5,-2.62; 13 9,-7.62; 14 5.5,-2.62; 15 2,-7.62; 16 -1.5,-2.62
LED5MM = drill 0.813 octagon: A -1.27,0; K 1.27,0
CONV_TSR_1-2450 = drill 0.85 square: 1 -2.54,-1.75 | drill 0.85: 2 0,-1.75; 3 2.54,-1.75
0204/7 = drill 0.813 octagon: 1 -3.81,0; 2 3.81,0
TSR2-SINGLE_TRP = drill 0.711 pad 1.219 square: 1 0,0 | drill 0.711 pad 1.219: 2 2.54,0; 3 5.08,0
SOIC127P599X175-14 = smd 1.967 x 0.594: 1 -2.469,3.81; 2 -2.469,2.54; 3 -2.469,1.27; 4 -2.469,0; 5 -2.469,-1.27; 6 -2.469,-2.54; 7 -2.469,-3.81; 8 2.469,-3.81; 9 2.469,-2.54; 10 2.469,-1.27; 11 2.469,0; 12 2.469,1.27; 13 2.469,2.54; 14 2.469,3.81

### Placement (x,y rotation side)
C1  10.79,64.77 0 top
C2  36.2,85.09 0 top
C3  61.59,85.09 0 top
CR1  11.43,129.54 270 top
CR2  11.43,109.22 270 top
CR3  11.43,88.9 270 top
CR4  11.43,69.85 270 top
CR5  36.83,129.54 270 top
CR6  36.83,109.22 270 top
CR7  36.83,90.17 270 top
CR8  62.23,129.54 270 top
CR9  62.23,109.22 270 top
CR10  62.23,90.17 270 top
D1  80.8,14.61 0 top
J1  17.78,139.7 90 top
J2  17.78,119.38 90 top
J3  17.78,99.06 90 top
J4  17.78,78.74 90 top
J5  43.18,139.7 90 top
J6  43.18,119.38 90 top
J7  43.18,99.06 90 top
J8  68.58,139.7 90 top
J9  68.58,119.38 90 top
J10  68.58,99.06 90 top
J11  81.28,12.7 0 bottom
LED1  -1.27,-3.81 0 top  (outside the outline)
LED2  -1.27,-10.79 0 top  (outside the outline)
LED3  -1.27,-17.78 0 top  (outside the outline)
LED4  -1.27,-24.77 0 top  (outside the outline)
LED5  -1.27,-31.75 0 top  (outside the outline)
LED6  -1.27,-38.73 0 top  (outside the outline)
LED7  -1.27,-45.72 0 top  (outside the outline)
LED8  -1.27,-52.7 0 top  (outside the outline)
LED9  -1.27,-59.69 0 top  (outside the outline)
LED10  74.3,19.68 90 top
PS1  81.28,41.91 90 bottom
R1  17.78,15.24 180 top
R2  17.78,10.16 0 top
R3  17.78,40.64 180 top
R4  17.78,38.1 0 top
R5  17.78,55.88 0 top
R6  17.78,53.34 180 top
R7  17.78,30.48 180 top
R8  17.78,27.94 0 top
R9  17.78,20.32 180 top
R10  17.78,45.72 180 top
R11  17.78,43.18 0 top
R12  17.78,17.78 0 top
R13  17.78,12.7 0 top
R14  17.78,35.56 0 top
R15  17.78,50.8 180 top
R16  17.78,25.4 0 top
R17  17.78,7.62 180 top
R18  17.78,33.02 0 top
R19  17.78,48.26 180 top
R20  17.78,22.86 0 top
R21  43.18,63.5 180 top
R22  43.18,60.96 0 top
R23  43.18,76.2 0 top
R24  43.18,73.66 180 top
R25  43.18,48.26 0 top
R26  43.18,50.8 180 top
R27  43.18,66.04 180 top
R28  43.18,53.34 0 top
R29  43.18,40.64 0 top
R30  43.18,58.42 0 top
R31  43.18,71.12 180 top
R32  43.18,45.72 180 top
R33  43.18,55.88 0 top
R34  43.18,68.58 180 top
R35  43.18,43.18 0 top
R36  68.58,63.5 180 top
R37  68.58,60.96 0 top
R38  68.58,76.2 0 top
R39  68.58,73.66 180 top
R40  68.58,48.26 0 top
R41  68.58,50.8 180 top
R42  68.58,66.04 180 top
R43  68.58,53.34 0 top
R44  68.58,40.64 0 top
R45  68.58,58.42 0 top
R46  68.58,71.12 180 top
R47  68.58,45.72 180 top
R48  68.58,55.88 0 top
R49  68.58,68.58 180 top
R50  74.3,32.38 90 top
RLA1  81.28,22.86 90 bottom
U1  17.78,63.5 0 top
U2  43.18,83.82 0 top
U3  68.58,83.82 0 top

### Tracks (layer width: path | path; a pad name or v marks a point on that pad's centre or on a via)
+5V  (4 unrouted)
  Top 0.508: C3.2 U3.3 67.94,85.09 68.58,84.45 68.58,76.2 | 68.58,76.2 68.58,53.34 | 68.58,53.34 68.58,48.26 | 68.58,48.26 68.58,40.64 | R44.2 68.58,40.64 | R40.2 68.58,48.26 | R43.2 68.58,53.34 | 68.58,76.2 R38.2 | 43.18,76.2 43.18,84.45 42.55,85.09 U2.3 C2.2 | 43.18,76.2 43.18,53.34 | 43.18,53.34 43.18,48.26 | 43.18,48.26 43.18,40.64 | R29.2 43.18,40.64 | R27.2 R21.2 | R42.2 R36.2 | R25.2 43.18,48.26 | R28.2 43.18,53.34 | R23.2 43.18,76.2 | 68.58,40.64 68.58,17.78 67.94,17.14 43.18,17.14 | 43.18,17.14 27.3,17.14 26.67,16.51 26.67,12.06 | 43.18,40.64 43.18,17.14 | C1.2 U1.3 17.14,64.77 17.78,64.14 17.78,55.88 | 26.67,12.06 26.67,6.99 26.04,6.35 18.41,6.35 17.78,6.99 17.78,15.24 | 17.78,15.24 17.78,17.78 | 17.78,17.78 17.78,20.32 | 17.78,20.32 17.78,30.48 | 17.78,30.48 17.78,40.64 | 17.78,40.64 17.78,43.18 | 17.78,43.18 17.78,55.88 | R1.2 17.78,15.24 | R12.2 17.78,17.78 | R5.2 17.78,55.88 | R11.2 17.78,43.18 | R3.2 17.78,40.64 | R7.2 17.78,30.48 | R9.2 17.78,20.32 | RLA1.3 76.83,27.94 76.83,43.81 77.47,44.45 PS1.3 | J11.3 37.28,11.62 36.83,12.06 26.67,12.06
+24V
  Top 0.508: J11.16 82.78,14.38 D1.2
+24VP  (9 unrouted)
  Top 0.508: J11.14 75.86,10.16 78.11,10.16 78.74,10.79 78.74,14.47 D1.1 78.6,22.09 79.38,22.86 RLA1.1 83.19,24.77 83.19,38.73 82.55,39.37 PS1.1
GND  (via drill 0.35)
  Top 0.508: U2.12 v47.31,85.09 | U1.12 v22.23,64.77 | U2.12 U2.11 U2.10 | U2.12 U2.13 | U3.12 v73.03,85.09 | U3.12 U3.11 U3.10 | U3.12 U3.13 | CR1.1 10.46,131.27 v10.48,131.29 | CR2.1 10.46,110.95 v10.48,110.97 | CR3.1 10.46,90.63 v10.48,90.65 | CR4.1 10.46,71.58 v10.48,71.6 | CR5.1 35.87,131.27 v35.88,131.29 | CR7.1 35.87,91.9 v35.88,91.92 | CR10.1 61.27,91.9 v61.28,91.92 | CR8.1 61.27,131.27 v61.28,131.29
  other vias: 35.88,110.97 61.28,110.97
  pour Bottom: 0,0 88.9,0 88.9,152.4 0,152.4
REF1
  Top 0.254: R2.2 R13.2 R1.1 22.86,15.24 23.5,15.88 23.5,38.73 24.77,40.01 24.77,62.87 24.13,63.5 U1.11
REF2
  Top 0.254: U1.9 22.86,60.96 23.5,60.33 23.5,41.27 22.86,40.64 R3.1 R4.2 R14.2
REF3
  Top 0.254: R15.2 R6.2 R5.1 13.97,59.05 14.61,59.69 U1.7
REF4  (via drill 0.35)
  Top 0.254: R16.2 R8.2 R7.1 21.59,31.75 v19.05,31.75 | U1.5 12.7,62.23 12.06,61.59 12.06,43.18 12.7,42.55 12.7,32.38 13.34,31.75 v16.51,31.75
  Bottom 0.254: v19.05,31.75 v16.51,31.75
REF5
  Top 0.254: U2.9 47.62,81.28 48.9,80.01 48.9,64.01 48.05,63.5 R21.1 R22.2 R30.2
REF6
  Top 0.254: R31.2 R24.2 R23.1 39.37,79.38 40.01,80.01 U2.7
REF7
  Top 0.254: R32.2 R25.1 R26.2 38.1,50.8 37.47,51.44 37.47,81.92 38.1,82.55 U2.5
REF8
  Top 0.254: U3.9 73.66,81.28 74.3,80.64 74.3,63.88 73.66,63.5 R36.1 R37.2 R45.2
REF9
  Top 0.254: R46.2 R39.2 R38.1 64.77,79.38 65.41,80.01 U3.7
REF10
  Top 0.254: R47.2 R40.1 R41.2 63.5,50.8 62.87,51.44 62.87,81.92 63.5,82.55 U3.5
THER1-IN  (via drill 0.35)  (4 unrouted)
  Top 0.254: U1.10 23.5,62.23 24.13,61.59 24.13,40.64 22.86,39.37 22.86,20.95 R9.1 | J1.4 26.67,139.7 27.3,139.06 27.3,45.72 26.04,44.45 26.04,38.73 24.77,37.47 v24.77,20.32 | 23.5,7.62 24.13,8.26 24.13,38.1 25.4,39.37 25.4,65.41 24.77,66.04 U1.13 | R13.1 v16.51,12.7 | 19.68,7.62 19.05,8.26 v19.05,12.7
  Top 0.508: CR1.3 12.39,139.4 12.7,139.7 J1.4
  Bottom 0.254: v24.77,20.32 R9.1 | v16.51,12.7 v19.05,12.7
THER1-SIG  (1 unrouted)
  Top 0.254: 13.34,12.7 12.7,12.06 12.7,5.71 13.34,5.08 27.3,5.08 27.94,5.71 27.94,9.53 28.57,10.16 33.7,10.16 J11.2
THER2-IN  (via drill 0.35)  (4 unrouted)
  Top 0.254: J2.4 16.51,119.38 26.04,119.38 26.67,118.75 26.67,46.35 v26.04,45.72 | R10.1 22.23,45.72 22.86,46.35 22.86,59.05 22.23,59.69 U1.8
  Top 0.508: CR2.3 12.39,115.9 15.88,119.38 16.51,119.38
  Bottom 0.254: v26.04,45.72 R10.1
THER2-SIG  (via drill 0.35)  (1 unrouted)
  Top 0.254: 17.78,67.31 17.14,67.94 9.53,67.94 8.89,67.31 8.89,62.87 10.16,61.59 10.16,41.27 10.79,40.64 v10.79,33.02 | v9.53,33.02 9.53,4.45 10.16,3.81 43.18,3.81 44.28,4.91 J11.5
  Bottom 0.254: v10.79,33.02 v9.53,33.02
THER3-IN  (via drill 0.35)  (4 unrouted)
  Top 0.254: R11.1 13.34,43.18 12.7,43.81 12.7,60.33 13.34,60.96 U1.6 | J3.4 15.88,99.06 8.26,99.06 7.62,98.42 7.62,61.59 8.89,60.33 v8.89,43.18
  Top 0.508: CR3.3 12.39,95.58 15.88,99.06
  Bottom 0.254: v8.89,43.18 R11.1
THER3-SIG  (via drill 0.35)  (1 unrouted)
  Top 0.254: 16.51,67.31 17.14,66.67 25.4,66.67 26.04,66.04 v26.04,48.26 | v27.94,15.88 28.57,15.24 46.99,15.24 47.78,14.45 J11.6 | v27.94,48.26 v27.94,18.41
  Bottom 0.254: v26.04,48.26 v27.94,48.26 | v27.94,18.41 v27.94,15.88
THER4-IN  (via drill 0.35)  (4 unrouted)
  Top 0.254: J4.4 8.89,78.74 8.26,78.11 8.26,62.23 9.53,60.96 9.53,40.64 10.16,40.01 10.16,31.11 11.43,29.84 v11.43,17.78 | U1.4 12.06,63.5 11.43,62.87 11.43,42.55 12.06,41.91 12.06,31.75 12.7,31.11 12.7,19.05 R12.1
  Top 0.508: CR4.3 12.39,75.11 J4.4
  Bottom 0.254: v11.43,17.78 R12.1
THER4-SIG  (via drill 0.35)  (1 unrouted)
  Top 0.254: 10.16,66.04 9.53,65.41 9.53,63.5 10.79,62.23 10.79,41.91 11.43,41.27 11.43,31.11 12.06,30.48 v12.06,25.4 12.06,5.08 12.7,4.45 29.64,4.45 J11.1
THER5-IN  (via drill 0.35)  (4 unrouted)
  Top 0.254: U2.8 47.62,80.01 48.26,79.38 48.26,66.67 47.62,66.04 R27.1 | v49.53,66.04 49.53,69.85 50.16,70.48 50.16,139.06 49.53,139.7 J5.4
  Top 0.508: CR5.3 37.8,136.22 41.27,139.7 J5.4
  Bottom 0.254: R27.1 v49.53,66.04
THER5-SIG  (via drill 0.35)  (2 unrouted)
  Top 0.254: 43.81,87.63 43.18,88.27 34.92,88.27 34.29,87.63 34.29,83.19 35.56,81.92 v35.56,58.42 | J11.7 51.28,15.39 50.8,15.88 v33.66,15.88 | v33.66,58.42 v33.66,18.41
  Bottom 0.254: v35.56,58.42 v33.66,58.42 | v33.66,18.41 v33.66,15.88
THER6-IN  (via drill 0.35)  (4 unrouted)
  Top 0.254: U2.6 38.73,81.28 38.1,80.64 38.1,53.98 38.73,53.34 R28.1 | J6.4 41.27,119.38 33.66,119.38 33.02,118.75 33.02,81.92 34.29,80.64 34.29,57.15 34.92,56.52 v34.92,53.34
  Top 0.508: CR6.3 37.8,115.9 41.27,119.38
  Bottom 0.254: v34.92,53.34 R28.1
THER6-SIG  (via drill 0.35)  (1 unrouted)
  Top 0.254: 42.55,87.63 43.18,87 48.9,87 49.53,86.36 v49.53,71.12 | v50.8,71.12 55.88,71.12 56.52,70.48 v56.52,18.41 | v56.52,15.88 56.52,6.99 58.28,5.22 J11.9
  Bottom 0.254: v49.53,71.12 v50.8,71.12 | v56.52,18.41 v56.52,15.88
THER7-IN  (via drill 0.35)  (4 unrouted)
  Top 0.254: U2.4 37.47,83.82 36.83,83.19 36.83,50.8 38.1,49.53 38.1,40.64 | J7.4 34.29,99.06 33.66,98.42 33.66,82.55 34.92,81.28 34.92,57.78 35.56,57.15 35.56,41.27 36.2,40.64 38.1,40.64 | 38.1,40.64 R29.1 | U2.2 35.56,86.36 34.92,85.72 34.92,83.82 36.2,82.55 36.2,50.16 37.47,48.9 v37.47,43.18 | v44.45,43.18 44.45,45.09 45.09,45.72 R32.1
  Top 0.508: CR7.3 37.8,95.42 J7.4
  Bottom 0.254: v41.91,43.18 v44.45,43.18
THER7-SIG  (via drill 0.35)  (1 unrouted)
  Top 0.254: 53.98,45.72 54.61,45.09 v54.61,18.41 | v54.61,15.88 54.61,10.16 54.69,10.08 J11.8
  Bottom 0.254: v54.61,18.41 v54.61,15.88
THER8-IN  (via drill 0.35)  (4 unrouted)
  Top 0.254: U3.8 72.95,78.11 73.03,78.11 73.66,77.47 73.66,66.67 73.03,66.04 R42.1 | J8.4 67.31,139.7 73.03,139.7 75.56,137.16 75.56,50.16 | 75.56,70.48 74.93,69.85 v74.93,66.04
  Top 0.508: CR8.3 63.2,136.22 66.67,139.7 67.31,139.7
  Bottom 0.254: v74.93,66.04 R42.1
THER8-SIG  (via drill 0.35)  (1 unrouted)
  Top 0.254: 69.22,87.63 68.58,88.27 60.33,88.27 59.69,87.63 59.69,83.19 60.96,81.92 v60.96,58.42 | v59.05,58.42 59.05,41.27 61.59,38.73 v61.59,18.41 | J11.10 61.67,10.08 61.59,10.16 v61.59,15.88
  Bottom 0.254: v60.96,58.42 v59.05,58.42 | v61.59,18.41 v61.59,15.88
THER9-IN  (via drill 0.35)  (4 unrouted)
  Top 0.254: U3.6 64.14,81.28 63.5,80.64 63.5,53.98 64.14,53.34 R43.1 | J9.4 59.05,119.38 58.42,118.75 58.42,81.92 59.69,80.64 59.69,57.78 60.33,57.15 v60.33,53.34
  Top 0.508: CR9.3 63.2,115.75 J9.4
  Bottom 0.254: v60.33,53.34 R43.1
THER9-SIG  (via drill 0.35)  (2 unrouted)
  Top 0.254: 67.94,87.63 68.58,87 74.3,87 74.93,86.36 v74.93,71.12 | J11.11 67.19,3.17 85.72,3.17 86.36,3.81 86.36,50.16 85.72,50.8 v76.2,50.8
  Bottom 0.254: v74.93,71.12 74.93,52.07 v76.2,50.8
THER10-IN  (via drill 0.35)  (4 unrouted)
  Top 0.254: U3.4 62.87,83.82 62.23,83.19 62.23,50.8 63.5,49.53 63.5,40.64 | J10.4 59.69,99.06 59.05,98.42 59.05,82.55 60.33,81.28 60.33,57.78 60.96,57.15 60.96,41.27 61.59,40.64 63.5,40.64 | R44.1 63.5,40.64 | U3.2 60.96,86.36 60.33,85.72 60.33,83.82 61.59,82.55 61.59,50.16 62.87,48.9 v62.87,43.18 | R47.1 70.48,45.72 69.85,45.09 v69.85,43.18
  Top 0.508: CR10.3 63.2,95.42 J10.4
  Bottom 0.254: v67.31,43.18 v69.85,43.18
THER10-SIG
  Top 0.254: J11.12 68.78,14.8 69.22,15.24 73.66,15.24 74.3,15.88 LED10.A

### Text on the board
tPlace: VLMi LN2 Thermistor Sensors | Omit pullups R17, R18, R19, R20, / R33, R34, R35, R48, R49, and R50 / for dry contact inputs | Use Advantech Adam 6251-B / Digital Input to Ethernet | 2023-07-26 | o | o | o | o | o | o | +5V | o | o | o | +24VP | o
bPlace: Use only one of these | T4 | T1 | +5V | COM | T2 | T3 | T5 | T7 | T6 | T8 | T9 | T10 | GND | 24VP | GND | 24V